# EAGLE design v1 (EAGLE 7.5.0)
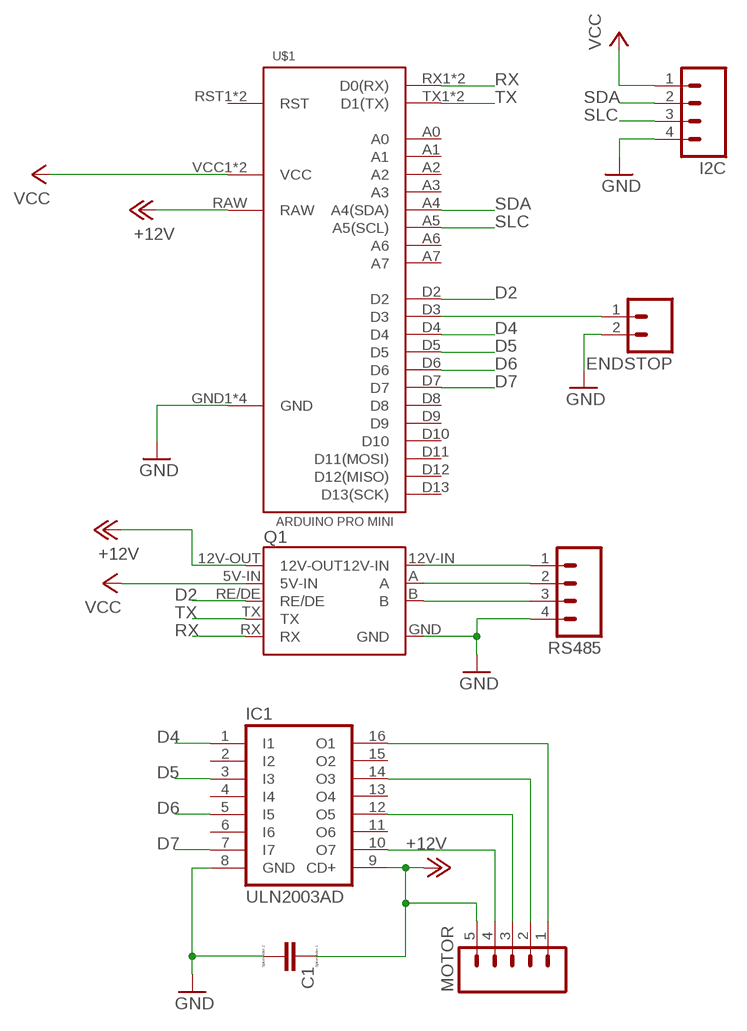
[diagram p0: schematic, sheet 1]

## Parts
C1  CC0603  [C0603]
ENDSTOP  M02  [02P]
I2C  M04  [04P]
IC1  ULN2003AD  [SO16]
MOTOR  M05  [05P]
Q1  RS485-ADAPTER0.05-CONNECTOR  [RS485-ADAPTOR-05]
RS485  M04  [04P]
U$1  ARDUINO-PRO-MINI  [ARDUINO-PRO-MINI]

## Nets
+12V: C1.1 IC1.9(CD+) MOTOR.5 Q1.12V-OUT U$1.RAW
D2: Q1.RE/DE U$1.D2
D4: IC1.1(I1) U$1.D4
D5: IC1.3(I3) U$1.D5
D6: IC1.5(I5) U$1.D6
D7: IC1.7(I7) U$1.D7
GND: C1.2 ENDSTOP.2 I2C.4 IC1.8(GND) Q1.GND RS485.4 U$1.GND1(GND) U$1.GND2(GND) U$1.GND3(GND) U$1.GND4(GND)
N$1: Q1.12V-IN RS485.1
N$2: IC1.16(O1) MOTOR.1
N$3: IC1.14(O3) MOTOR.2
N$4: IC1.12(O5) MOTOR.3
N$5: IC1.10(O7) MOTOR.4
N$10: Q1.A RS485.2
N$11: Q1.B RS485.3
N$12: ENDSTOP.1 U$1.D3
RX: Q1.RX U$1.RX1(D0(RX)) U$1.RX2(D0(RX))
SDA: I2C.2 U$1.A4(A4(SDA))
SLC: I2C.3 U$1.A5(A5(SCL))
TX: Q1.TX U$1.TX1(D1(TX)) U$1.TX2(D1(TX))
VCC: I2C.1 Q1.5V-IN U$1.VCC1(VCC) U$1.VCC2(VCC)
Unconnected: IC1.2(I2) IC1.4(I4) IC1.6(I6) IC1.11(O6) IC1.13(O4) IC1.15(O2) U$1.A0 U$1.A1 U$1.A2 U$1.A3 U$1.A6 U$1.A7 U$1.D8 U$1.D9 U$1.D10 U$1.D11(D11(MOSI)) U$1.D12(D12(MISO)) U$1.D13(D13(SCK)) U$1.RST1(RST) U$1.RST2(RST)

## Library data of the parts
C1 = eagle-ltspice:C: CAPACITOR, European symbol; SPICEMODEL: NONE; SPICEPREFIX: C
ENDSTOP = con-amp-quick:M02: AMP QUICK CONNECTOR; OC_FARNELL: unknown; OC_NEWARK: unknown
I2C RS485 = con-amp-quick:M04: AMP QUICK CONNECTOR; OC_FARNELL: unknown; OC_NEWARK: unknown
IC1 = uln-udn:ULN2003A: DRIVER ARRAY
MOTOR = con-amp-quick:M05: AMP QUICK CONNECTOR; OC_FARNELL: unknown; OC_NEWARK: unknown
Q1 = serge:RS485-ADAPTER
U$1 = serge:ARDUINO-PRO-MINI

## Board
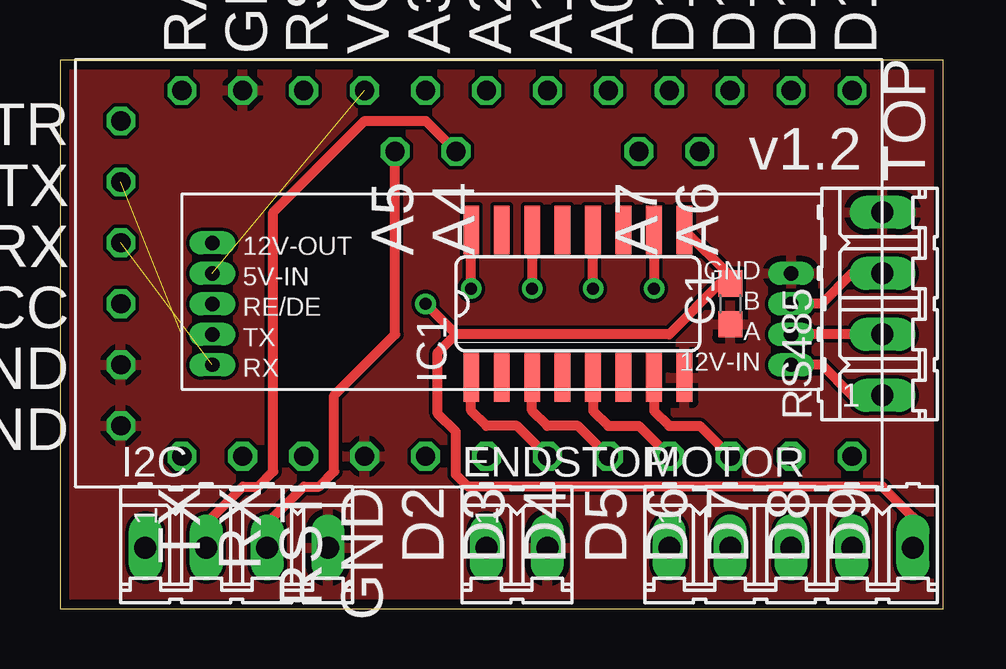
[diagram p1: board, top side]
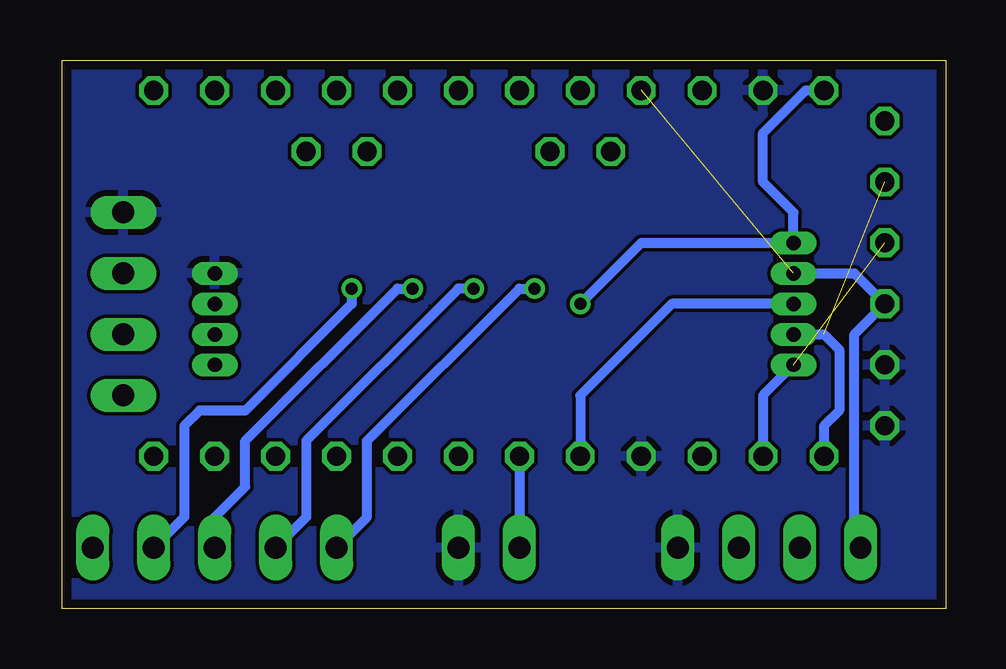
[diagram p2: board, bottom side, seen from below]

Size 36.83 x 22.86 mm. Coordinates in mm from the lower left corner, seen from the top.
Outline: 0,0 36.83,0 36.83,22.86 0,22.85 0,0
Copper layers (1*16): Top 0.0356mm / dielectric 1.5011mm / Bottom 0.0356mm
Design rules "LaenPCBOrder": minimum track width 6mil, minimum drill 13mil, track to track 6mil, track to pad 6mil, pad to pad 6mil, via to via 6mil, smd to smd 6mil, copper to edge 15mil, drill to drill 6mil, minimum pad ring 7mil, minimum via ring 7mil, stop-mask expansion 4mil, vias tented up to drill 0mil, thermal gap 10mil

### Footprints (pad centres in the part's own frame; a part is rotated, then mirrored left to right if it is on the bottom)
C0603 = smd 1.1 x 1: 1 -0.85,0; 2 0.85,0
02P = drill 0.914 long: 1 -1.27,0; 2 1.27,0
04P = drill 0.914 long: 1 -3.81,0; 2 -1.27,0; 3 1.27,0; 4 3.81,0
SO16 = smd 0.66 x 2.032: 1 -4.445,-3.073; 2 -3.175,-3.073; 3 -1.905,-3.073; 4 -0.635,-3.073; 5 0.635,-3.073; 6 1.905,-3.073; 7 3.175,-3.073; 8 4.445,-3.073; 9 4.445,3.073; 10 3.175,3.073; 11 1.905,3.073; 12 0.635,3.073; 13 -0.635,3.073; 14 -1.905,3.073; 15 -3.175,3.073; 16 -4.445,3.073
05P = drill 0.914 long: 1 -5.08,0; 2 -2.54,0; 3 0,0; 4 2.54,0; 5 5.08,0
RS485-ADAPTOR-05 = drill 0.6 pad 0.9 long: 5V-IN -11.43,1.27; 12V-IN 12.7,-2.54; 12V-OUT -11.43,2.54; A 12.7,-1.27; B 12.7,0; GND 12.7,1.27; RE/DE -11.43,0; RX -11.43,-2.54; TX -11.43,-1.27
ARDUINO-PRO-MINI = drill 0.8 octagon: A0 -3.81,-7.62; A1 -1.27,-7.62; A2 1.27,-7.62; A3 3.81,-7.62; A4 2.54,-5.08; A5 5.08,-5.08; A6 -7.62,-5.08; A7 -5.08,-5.08; D2 3.81,7.62; D3 1.27,7.62; D4 -1.27,7.62; D5 -3.81,7.62; D6 -6.35,7.62; D7 -8.89,7.62; D8 -11.43,7.62; D9 -13.97,7.62; D10 -13.97,-7.62; D11 -11.43,-7.62; D12 -8.89,-7.62; D13 -6.35,-7.62; DTR 16.51,-6.35; GND1 11.43,-7.62; GND2 16.51,6.35; GND3 16.51,3.81; GND4 6.35,7.62; RAW 13.97,-7.62; RST1 8.89,7.62; RST2 8.89,-7.62; RX1 11.43,7.62; RX2 16.51,-1.27; TX1 13.97,7.62; TX2 16.51,-3.81; VCC1 16.51,1.27; VCC2 6.35,-7.62

### Placement (x,y rotation side)
C1  27.94,12.7 270 top
ENDSTOP  19.05,2.54 0 top
I2C  7.37,2.54 0 top
IC1  21.59,12.7 0 top
MOTOR  30.48,2.54 0 top
Q1  17.78,12.7 0 top
RS485  34.29,12.7 90 top
U$1  19.05,13.97 180 top

### Tracks (layer width: path | path; a pad name or v marks a point on that pad's centre or on a via)
+12V  (via drill 0.5)
  Top 0.406: IC1.9 27.94,13.87 C1.1 27.52,13.55 25.4,11.43 16.51,11.43 | 16.51,11.43 v15.24,12.7 | MOTOR.5 35.56,3.81 34.29,5.08 17.02,5.08 16.51,5.59 16.51,7.37 15.75,8.13 15.75,10.67 16.51,11.43
  Bottom 0.406: v15.24,12.7 12.7,15.24 Q1.12V-OUT 6.35,16.51 7.62,17.78 7.62,19.81 5.84,21.59 U$1.RAW
D2
  Bottom 0.406: Q1.RE/DE 11.43,12.7 15.24,8.89 U$1.D2
D4
  Top 0.406: U$1.D4 19.05,7.62 17.78,7.62 17.14,8.25 IC1.1
D5
  Top 0.406: U$1.D5 21.59,7.62 20.32,7.62 19.68,8.25 IC1.3
D6
  Top 0.406: IC1.5 22.23,8.25 22.86,7.62 24.13,7.62 U$1.D6
D7
  Top 0.406: IC1.7 24.77,8.25 25.4,7.62 26.67,7.62 U$1.D7
GND
  pour Bottom: 0,0 0,22.86 36.83,22.86 36.83,0
  pour Top: 0,22.86 36.83,22.86 36.83,0 0,0
N$1
  Top 0.406: RS485.1 33.02,8.89 31.75,10.16 Q1.12V-IN
N$2  (via drill 0.5)
  Top 0.406: v17.14,13.33 IC1.16
  Bottom 0.406: MOTOR.1 24.13,3.81 24.13,6.98 17.78,13.33 v17.14,13.33
N$3  (via drill 0.5)
  Top 0.406: IC1.14 v19.68,13.33
  Bottom 0.406: v19.68,13.33 20.32,13.33 26.67,6.98 26.67,3.81 MOTOR.2
N$4  (via drill 0.5)
  Top 0.406: v22.23,13.33 IC1.12
  Bottom 0.406: MOTOR.3 30.48,3.81 29.21,5.08 29.21,6.98 22.86,13.33 v22.23,13.33
N$5  (via drill 0.5)
  Top 0.406: IC1.10 v24.77,13.33
  Bottom 0.406: v24.77,13.33 24.77,12.7 29.21,8.25 31.11,8.25 31.75,7.62 31.75,3.81 MOTOR.4
N$10
  Top 0.406: RS485.2 Q1.A
N$11
  Top 0.406: RS485.3 33.02,13.97 31.75,12.7 Q1.B
N$12
  Bottom 0.406: U$1.D3 ENDSTOP.1
RX  (1 unrouted)
  Bottom 0.406: Q1.RX 7.62,8.89 U$1.RX1
SDA
  Top 0.406: I2C.2 6.1,3.56 7.62,5.08 8.26,5.08 8.89,5.71 8.89,16.51 12.7,20.32 15.24,20.32 U$1.A4
SLC
  Top 0.406: U$1.A5 13.97,11.43 11.43,8.89 11.43,5.71 10.79,5.08 10.16,5.08 8.64,3.56 I2C.3
TX  (1 unrouted)
  Bottom 0.406: Q1.TX 5.08,11.43 4.45,10.79 4.45,8.25 5.08,7.62 U$1.TX1
VCC  (1 unrouted)
  Bottom 0.406: Q1.5V-IN 3.81,13.97 U$1.VCC1 3.81,11.43 3.81,2.79 I2C.1

### Text on the board
tNames: v1.2 | TOP